# EAGLE design atxpsudevboard_0-1b (EAGLE 6.0)
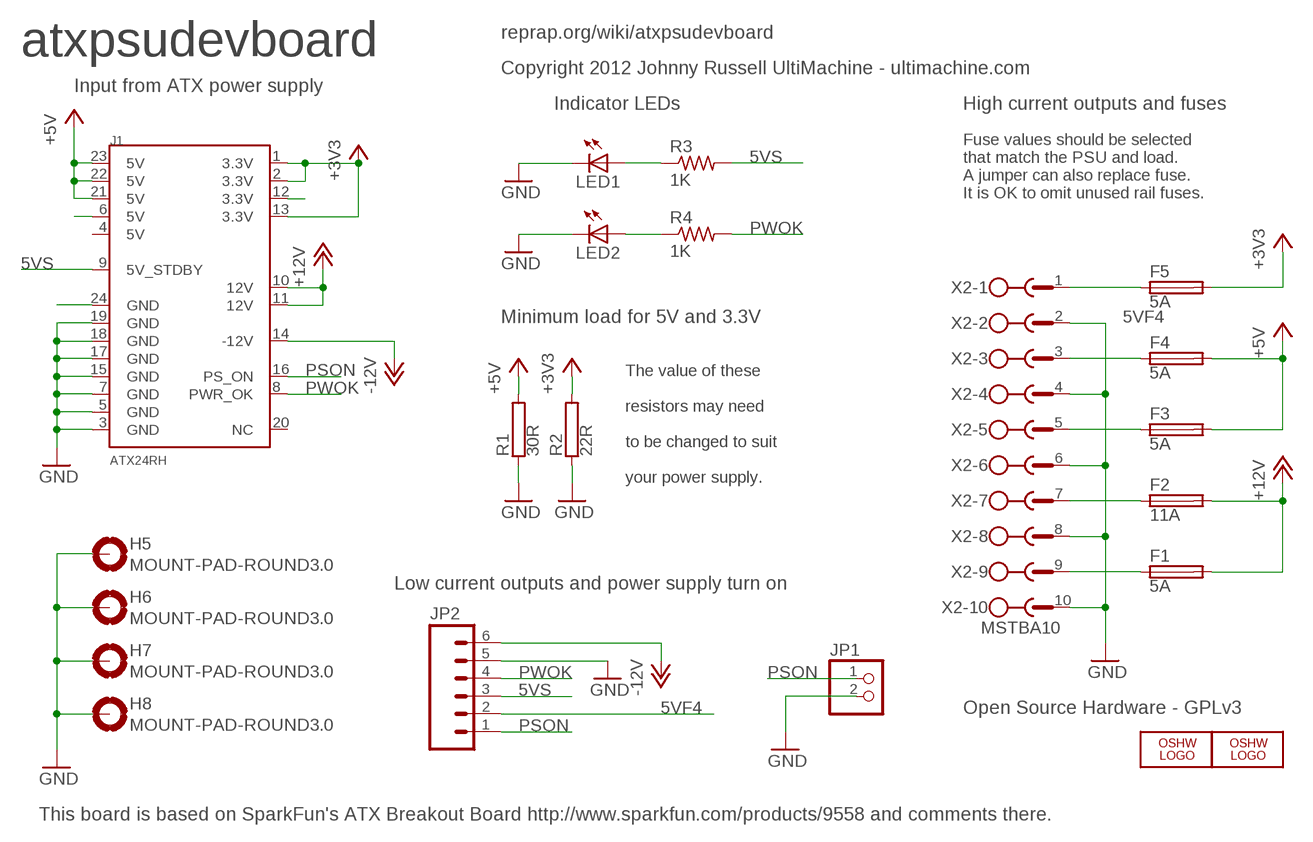
[diagram p0: schematic, sheet 1]

## Parts
F1  5A  PTCFUSEMFR1100  [MFR1100]
F2  11A  PTCFUSEMFR1100  [MFR1100]
F3  5A  PTCFUSEMFR1100  [MFR1100]
F4  5A  PTCFUSEMFR1100  [MFR1100]
F5  5A  PTCFUSEMFR1100  [MFR1100]
H5  MOUNT-PAD-ROUND3.0  [3,0-PAD]
H6  MOUNT-PAD-ROUND3.0  [3,0-PAD]
H7  MOUNT-PAD-ROUND3.0  [3,0-PAD]
H8  MOUNT-PAD-ROUND3.0  [3,0-PAD]
J1  ATX24RH  [ATX24_RIGHT_ANGLE]
JP1  PINHD-1X2  [1X02]
JP2  M06LONGPADS  [1X06_LONGPADS]
LED1  LED3MM  [LED3MM]
LED2  LED3MM  [LED3MM]
LOGO1  OSHW_LOGO_FILLX0100-NT  [OSHW_FILLX100_NOTEXT]
LOGO2  OSHW_LOGO_FILLX0200-NT  [OSHW_FILLX200_NOTEXT]
R1  30R  RHPS923  [HPS923]
R2  22R  RCA4050  [CA4050]
R3  1K  R-US_0207/7  [0207/7]
R4  1K  R-US_0207/7  [0207/7]
X2  MSTBA10  [MSTBA10]

## Nets
5VF4: F4.1 JP2.2 X2.3
5VS: J1.9(5V_STDBY) JP2.3 R3.2
+3V3: F5.2 J1.1(3.3V) J1.2(3.3V) J1.13(3.3V) R2.2
+5V: F3.2 F4.2 J1.21(5V) J1.22(5V) J1.23(5V) R1.2
+12V: F1.2 F2.2 J1.10(12V) J1.11(12V)
-12V: J1.14(-12V) JP2.6
GND: H5.B3,0(MOUNT) H6.B3,0(MOUNT) H7.B3,0(MOUNT) H8.B3,0(MOUNT) J1.3(GND) J1.5(GND) J1.7(GND) J1.15(GND) J1.17(GND) J1.18(GND) J1.19(GND) JP1.2 JP2.5 LED1.K(C) LED2.K(C) R1.1 R2.1 X2.2 X2.4 X2.6 X2.8 X2.10
N$1: F2.1 X2.7
N$2: F1.1 X2.9
N$3: J1.12(3.3V)
N$4: F3.1 X2.5
N$5: F5.1 X2.1
N$6: LED1.A R3.1
N$7: LED2.A R4.1
N$8: J1.6(5V)
N$9: J1.24(GND)
PSON: J1.16(PS_ON) JP1.1 JP2.1
PWOK: J1.8(PWR_OK) JP2.4 R4.2
Unconnected: J1.4(5V) J1.20(NC)

## Notes on the sheet
- reprap.org/wiki/atxpsudevboard
- atxpsudevboard
- Copyright 2012 Johnny Russell UltiMachine - ultimachine.com
- Input from ATX power supply
- Indicator LEDs | High current outputs and fuses
- Fuse values should be selected
- that match the PSU and load.
- A jumper can also replace fuse.
- It is OK to omit unused rail fuses.
- Minimum load for 5V and 3.3V
- The value of these
- resistors may need
- to be changed to suit
- your power supply.
- Low current outputs and power supply turn on
- Open Source Hardware - GPLv3
- This board is based on SparkFun's ATX Breakout Board http://www.sparkfun.com/products/9558 and comments there.

## Library data of the parts
F1-F5 = RepRapjr:PTCFUSE: LITTLEFUSE Picofuse/slow Littlefuse
H5-H8 = holes:MOUNT-PAD-ROUND: MOUNTING PAD, round
J1 = SparkFun:ATX24
JP1 = pinhead:PINHD-1X2: PIN HEADER
JP2 = SparkFun:M06: Header 6 Standard 6-pin 0.1" header. Use with straight break away headers (SKU : PRT-00116), right angle break away headers (PRT-00553), swiss pins (PRT-00743), machine pins (PRT-00117), and female headers (PRT-00115). Molex polarized connector foot print use with SKU : PRT-08094 with associated crimp pins and housings. NOTES ON THE VARIANTS LOCK and LOCK_LONGPADS... This footprint was designed to help hold the alignment of a through-hole component (i.e. 6-pin header) while soldering it into place. You may notice that each hole has been shifted either up or down by 0.005 of an inch from it's more standard position (which is a perfectly straight line). This slight alteration caused the pins (the squares in the middle) to touch the edges of the holes. Because they are alternating, it causes a "brace" to hold the component in place. 0.005 has proven to be the perfect amount of "off-center" position when using our standard breakaway headers. Although looks a little odd when you look at the bare footprint, once you have a header in there, the alteration is very hard to notice. Also, if you push a header all the way into place, it is covered up entirely on the bottom side. This idea of altering the position of holes to aid alignment will be further integrated into the Sparkfun Library for other footprints. It can help hold any component with 3 or more connection pins.
LED1 LED2 = led:LED: LED OSRAM: - CHIPLED LG R971, LG N971, LY N971, LG Q971, LY Q971, LO R971, LY R971 LH N974, LH R974 LS Q976, LO Q976, LY Q976 LO Q996 - Hyper CHIPLED LW Q18S LB Q993, LB Q99A, LB R99A - SideLED LS A670, LO A670, LY A670, LG A670, LP A670 LB A673, LV A673, LT A673, LW A673 LH A674 LY A675 LS A676, LA A676, LO A676, LY A676, LW A676 LS A679, LY A679, LG A679 - Hyper Micro SIDELED® LS Y876, LA Y876, LO Y876, LY Y876 LT Y87S - SmartLED LW L88C, LW L88S LB L89C, LB L89S, LG L890 LS L89K, LO L89K, LY L89K LS L896, LA L896, LO L896, LY L896 - TOPLED LS T670, LO T670, LY T670, LG T670, LP T670 LSG T670, LSP T670, LSY T670, LOP T670, LYG T670 LG T671, LOG T671, LSG T671 LB T673, LV T673, LT T673, LW T673 LH T674 LS T676, LA T676, LO T676, LY T676, LB T676, LH T676, LSB T676, LW T676 LB T67C, LV T67C, LT T67C, LS T67K, LO T67K, LY T67K, LW E67C LS E67B, LA E67B, LO E67B, LY E67B, LB E67C, LV E67C, LT E67C LW T67C LS T679, LY T679, LG T679 LS T770, LO T770, LY T770, LG T770, LP T770 LB T773, LV T773, LT T773, LW T773 LH T774 LS E675, LA E675, LY E675, LS T675 LS T776, LA T776, LO T776, LY T776, LB T776 LHGB T686 LT T68C, LB T68C - Hyper Mini TOPLED® LB M676 - Mini TOPLED Santana® LG M470 LS M47K, LO M47K, LY M47K Source: http://www.osram.convergy.de LUXEON: - LUMILED® LXK2-PW12-R00, LXK2-PW12-S00, LXK2-PW14-U00, LXK2-PW14-V00 LXK2-PM12-R00, LXK2-PM12-S00, LXK2-PM14-U00 LXK2-PE12-Q00, LXK2-PE12-R00, LXK2-PE12-S00, LXK2-PE14-T00, LXK2-PE14-U00 LXK2-PB12-K00, LXK2-PB12-L00, LXK2-PB12-M00, LXK2-PB14-N00, LXK2-PB14-P00, LXK2-PB14-Q00 LXK2-PR12-L00, LXK2-PR12-M00, LXK2-PR14-Q00, LXK2-PR14-R00 LXK2-PD12-Q00, LXK2-PD12-R00, LXK2-PD12-S00 LXK2-PH12-R00, LXK2-PH12-S00 LXK2-PL12-P00, LXK2-PL12-Q00, LXK2-PL12-R00 Source: www.luxeon.com KINGBRIGHT: KA-3528ASYC Source: www.kingbright.com
LOGO1 LOGO2 = OSHW:OSHW_LOGO_FILL
R1 R2 = resistor-power:R: Power Resitor; OC_FARNELL: unknown; OC_NEWARK: unknown
R3 R4 = resistor:R-US_: RESISTOR, American symbol
X2 = con-phoenix-508:MSTBA10: PHOENIX; MF: FARNELL; MPN: 1757323; OC_FARNELL: 3705249; OC_NEWARK: 71C4168

## Board
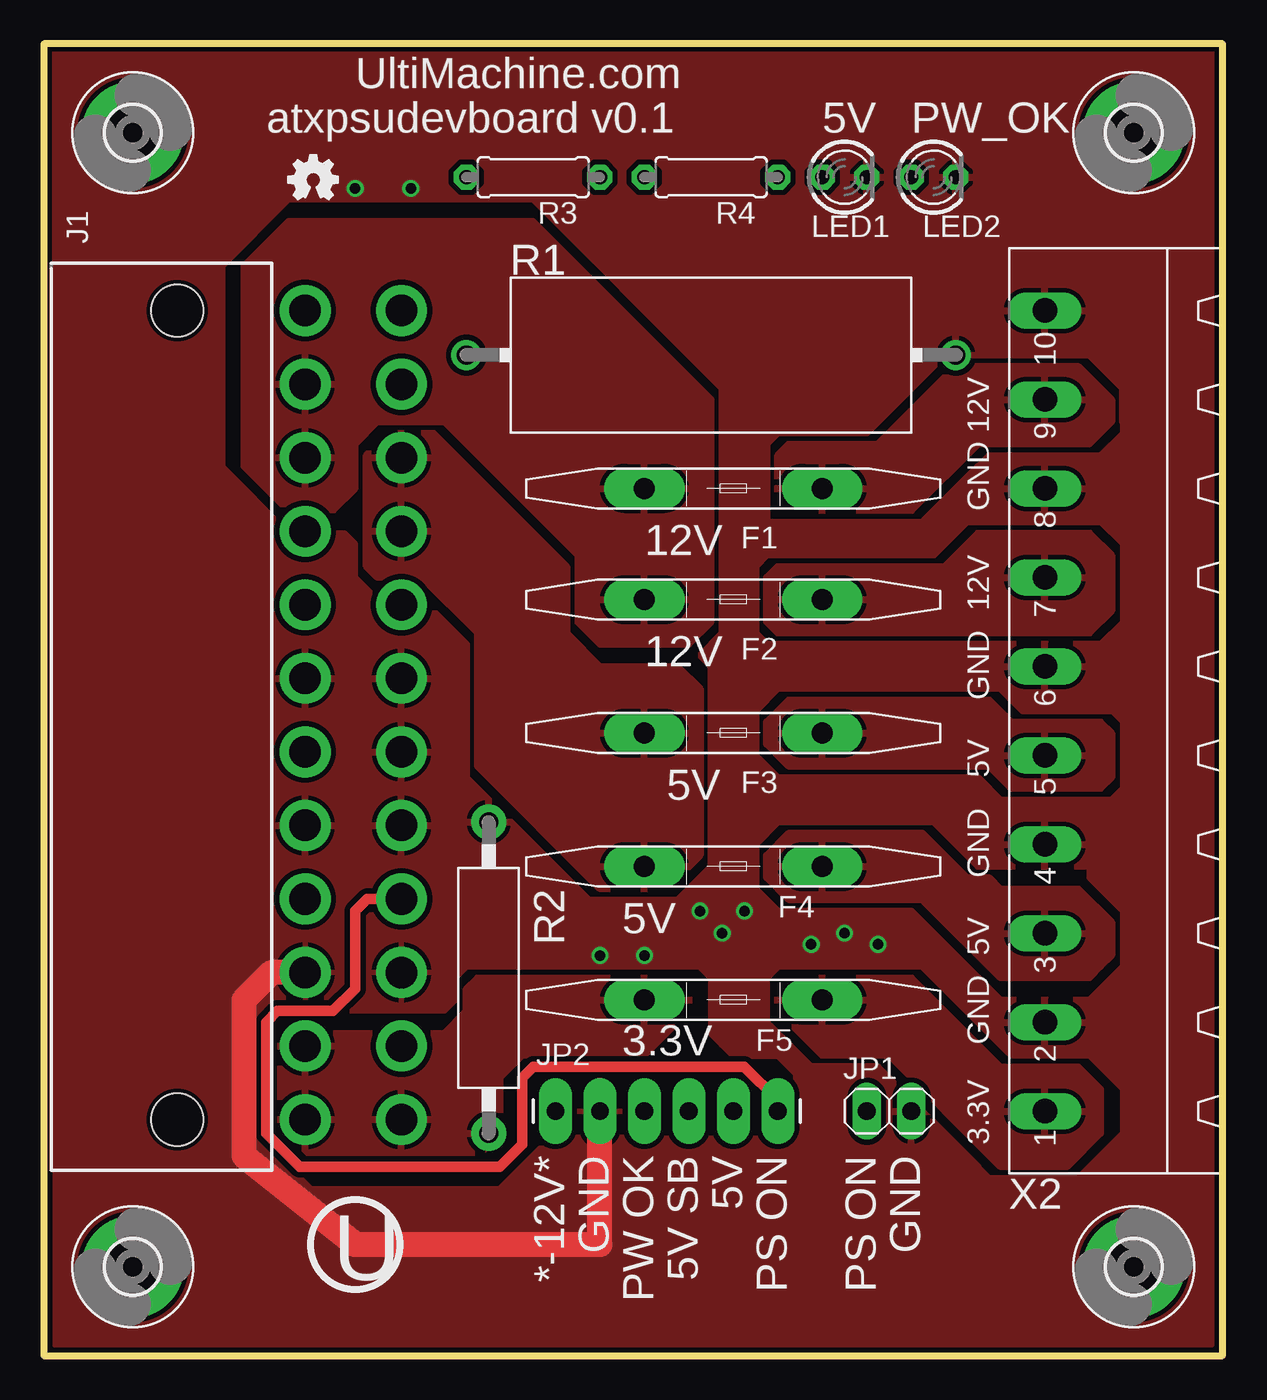
[diagram p1: board, top side]
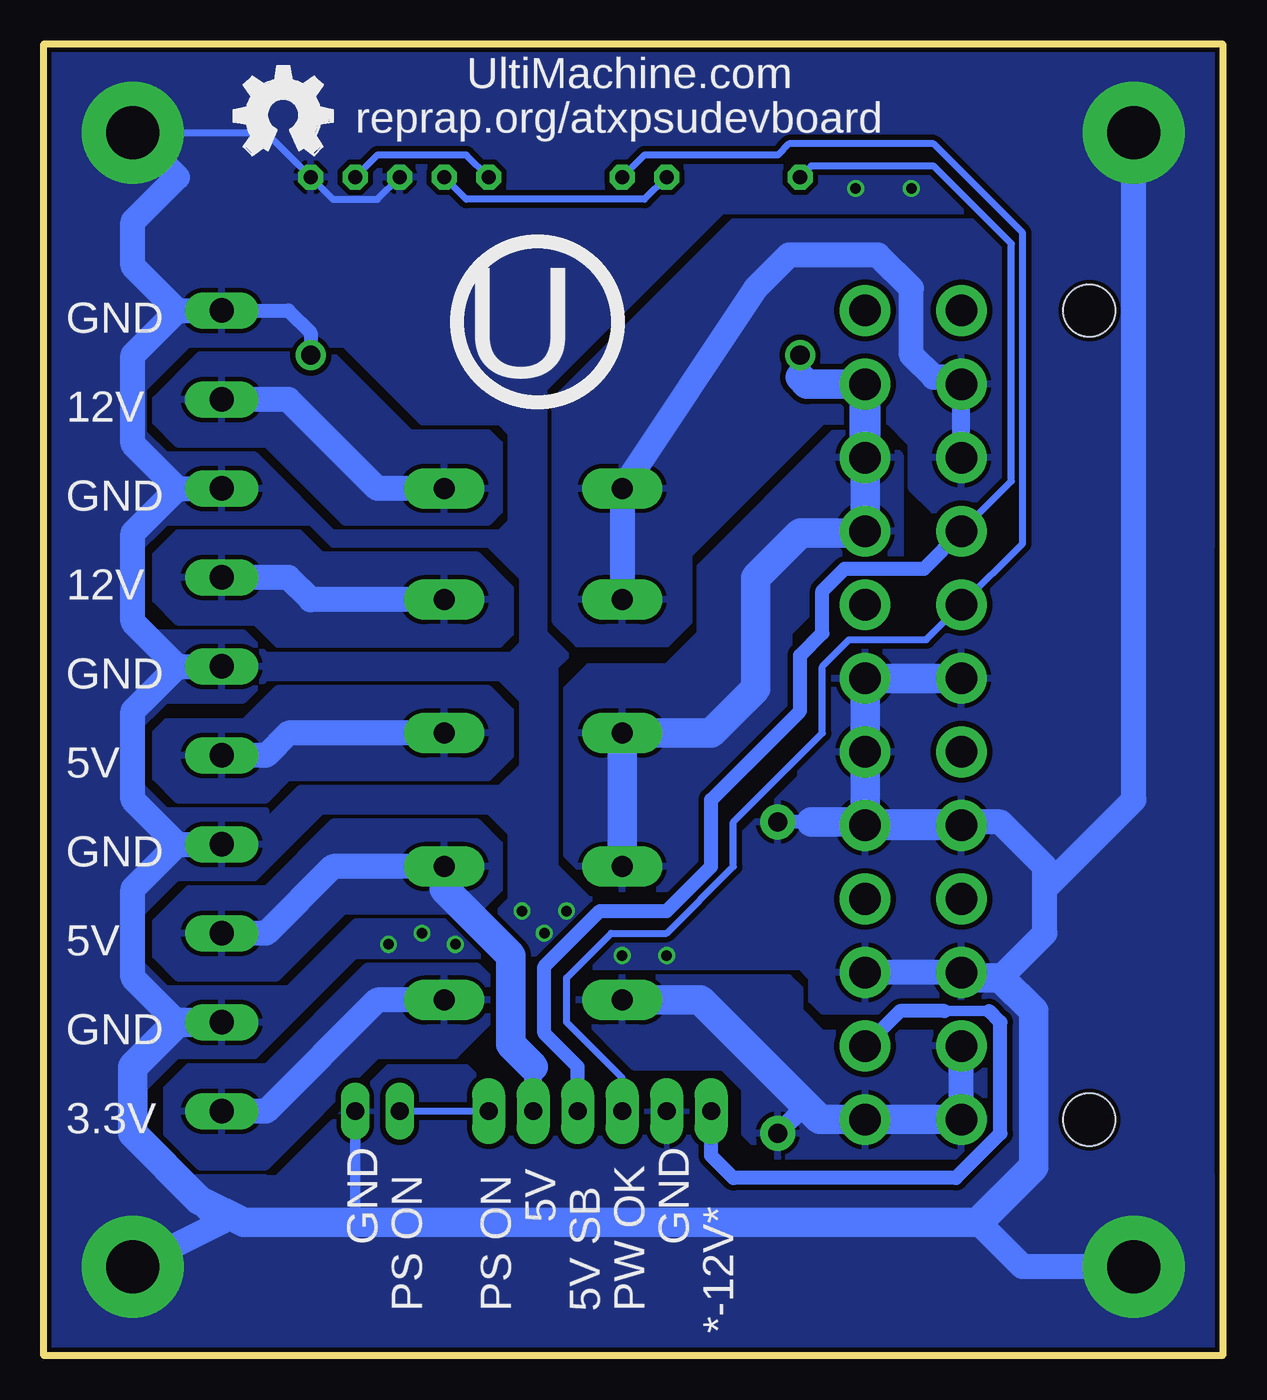
[diagram p2: board, bottom side, seen from below]

Size 67.31 x 74.93 mm. Coordinates in mm from the lower left corner, seen from the top.
Outline: 0,0 67.31,0 67.31,74.93 0,74.93 0,0
Copper layers (1*16): Top 0.035mm / dielectric 1.5mm / Bottom 0.035mm
Design rules: minimum track width 7mil, minimum drill 15mil, track to track 12mil, track to pad 12mil, pad to pad 7mil, via to via 7mil, smd to smd 7mil, copper to edge 10mil, drill to drill 8mil, minimum pad ring 12mil, minimum via ring 7mil, stop-mask expansion 4mil, vias tented up to drill 25mil, thermal gap 10mil

### Footprints (pad centres in the part's own frame; a part is rotated, then mirrored left to right if it is on the bottom)
MFR1100 = drill 1.2 pad 2.3 long: 1 -5.08,0; 2 5.08,0
3,0-PAD = drill 3 pad 5.842: B3,0 0,0
ATX24_RIGHT_ANGLE = drill 1.8 pad 2.9: 1 23.34,4.76; 2 19.14,4.76; 3 14.94,4.76; 4 10.74,4.76; 5 6.54,4.76; 6 2.34,4.76; 7 -1.86,4.76; 8 -6.06,4.76; 9 -10.26,4.76; 10 -14.46,4.76; 11 -18.66,4.76; 12 -22.86,4.76; 13 23.34,10.26; 14 19.14,10.26; 15 14.94,10.26; 16 10.74,10.26; 17 6.54,10.26; 18 2.34,10.26; 19 -1.86,10.26; 20 -6.06,10.26; 21 -10.26,10.26; 22 -14.46,10.26; 23 -18.66,10.26; 24 -22.86,10.26 | hole 3: -22.86,-2.54; 23.34,-2.54
1X02 = drill 1.016 long: 1 -1.27,0; 2 1.27,0
1X06_LONGPADS = drill 1.016 pad 1.88 long: 1 0,0; 2 2.54,0; 3 5.08,0; 4 7.62,0; 5 10.16,0; 6 12.7,0
LED3MM = drill 0.813 octagon: A -1.27,0; K 1.27,0
HPS923 = drill 1.1 pad 1.7: 1 -13.97,0; 2 13.97,0
CA4050 = drill 1.1 pad 2: 1 -8.89,0; 2 8.89,0
0207/7 = drill 0.813 octagon: 1 -3.81,0; 2 3.81,0
MSTBA10 = drill 1.397 long: 1 -22.86,5.08; 2 -17.78,5.08; 3 -12.7,5.08; 4 -7.62,5.08; 5 -2.54,5.08; 6 2.54,5.08; 7 7.62,5.08; 8 12.7,5.08; 9 17.78,5.08; 10 22.86,5.08

### Placement (x,y rotation side)
F1  39.37,49.53 180 top
F2  39.37,43.18 180 top
F3  39.37,35.56 180 top
F4  39.37,27.94 180 top
F5  39.37,20.32 180 top
H5  5.08,5.08 0 top
H6  5.08,69.85 0 top
H7  62.23,69.85 0 top
H8  62.23,5.08 0 top
J1  10.16,36.83 270 top
JP1  48.26,13.97 0 top
JP2  41.91,13.97 180 top
LED1  45.72,67.31 0 top
LED2  50.8,67.31 0 top
LOGO1  13.97,66.04 0 top
LOGO2  50.8,68.58 0 top
R1  38.1,57.15 180 top
R2  25.4,21.59 270 top
R3  27.94,67.31 180 top
R4  38.1,67.31 180 top
X2  62.23,36.83 90 top

### Tracks (layer width: path | path; a pad name or v marks a point on that pad's centre or on a via)
5VF4
  Bottom 1.016: JP2.2 39.37,16.51
  Bottom 1.422: X2.3 54.61,24.13 50.8,27.94 F4.1
  Bottom 1.676: 39.37,16.51 40.64,17.78 40.64,22.86 44.45,26.67 F4.1
  pour Top: 41.27,28.57 42.55,29.84 50.16,29.84 52.7,27.3 53.98,27.3 54.61,26.67 59.05,26.67 60.96,24.77 60.96,22.86 60.33,22.23 59.69,21.59 54.61,21.59 50.16,26.04 42.55,26.04 41.27,27.3
  pour Bottom: 41.27,29.21 42.55,30.48 50.8,30.48 54.61,26.67 59.05,26.67 60.96,24.77 60.96,22.86 59.69,21.59 53.98,21.59 50.16,25.4 42.55,25.4 41.27,26.67
5VS
  Bottom 0.406: J1.9 12.06,49.95 12.06,63.5 16.51,67.94 23.5,67.94 R3.2
  Bottom 0.813: JP2.3 36.83,16.51 38.73,18.41 38.73,22.23 35.56,25.4 31.75,25.4 29.21,27.94 29.21,31.75 24.13,36.83 24.13,40.01 22.86,41.27 22.86,43.69 21.59,44.96 17.05,44.96 J1.9
+3V3
  Bottom 1.016: 23.81,14.29 R2.2
  Bottom 1.422: J1.1 J1.2
  Bottom 1.676: F5.2 29.84,20.32 23.81,14.29 23.02,13.49 J1.13 J1.1
  pour Top: 13.34,17.78 13.97,18.41 22.86,18.41 24.13,19.68 24.13,20.95 24.77,21.59 36.2,21.59 36.83,20.95 36.83,19.68 34.29,17.14 27.3,17.14 26.04,15.88 26.04,12.7 24.77,11.43 15.24,11.43 13.34,13.34
  pour Bottom: 13.34,17.14 15.24,19.05 15.88,18.41 22.86,18.41 24.13,19.68 24.13,20.95 24.77,21.59 36.2,21.59 36.83,20.95 36.83,19.68 33.66,16.51 28.57,16.51 27.3,15.24 27.3,12.7 26.04,11.43 15.24,11.43 13.34,13.34
+5V
  Bottom 1.016: 24.13,55.88 R1.2
  Bottom 1.676: F4.2 F3.2 29.21,35.56 26.67,38.1 26.67,44.45 24.13,46.99 20.52,46.99 J1.21 J1.22 | J1.23 23.74,55.49 24.13,55.88
  Bottom 1.778: J1.22 J1.23
  pour Top: 18.41,51.44 19.68,52.7 22.23,52.7 29.84,45.09 29.84,41.27 31.75,39.37 36.2,39.37 37.47,38.1 37.47,28.57 35.56,26.67 31.75,26.67 24.77,33.66 24.77,41.27 21.59,44.45 19.05,44.45 18.41,45.09
  pour Bottom: 22.23,52.7 19.68,52.7 18.41,51.44 18.41,45.09 19.05,44.45 21.59,44.45 24.77,41.27 24.77,33.66 31.75,26.67 35.56,26.67 37.47,28.57 37.47,38.1 36.2,39.37 31.75,39.37 29.84,41.27 29.84,45.09
+12V
  Bottom 1.016: J1.10 J1.11
  Bottom 1.422: J1.11 15.31,55.88 16.51,55.88 17.78,57.15 17.78,60.96 19.68,62.87 24.77,62.87 26.67,60.96 F1.2 F2.2
  pour Top: 11.43,50.8 13.97,48.26 16.51,48.26 17.78,49.53 17.78,52.07 19.05,53.34 22.86,53.34 30.48,45.72 30.48,41.91 31.75,40.64 36.83,40.64 38.1,41.91 38.1,54.61 27.94,64.77 13.97,64.77 11.43,62.23
  pour Bottom: 11.43,62.23 11.43,50.8 13.34,48.9 13.97,48.26 16.51,48.26 17.78,49.53 17.78,52.07 19.05,53.34 22.86,53.34 30.48,45.72 30.48,41.91 31.75,40.64 36.83,40.64 38.1,41.91 38.1,54.61 27.94,64.77 13.97,64.77
-12V
  Bottom 0.61: 13.34,19.68 15.88,19.68
  Bottom 0.813: 13.34,19.68 12.7,19.05 12.7,12.7 15.24,10.16 27.94,10.16 29.21,11.43 JP2.6 | 15.88,19.68 18.43,19.68 J1.14
GND  (via drill 0.6)
  Top 1.422: JP2.5 31.75,6.35 17.78,6.35 11.43,11.43 11.43,20.32 13,21.89 J1.3
  Bottom 0.406: LED1.K 48.26,66.04 50.8,66.04 LED2.K 54.61,69.85 H7.B3,0
  Bottom 0.61: 49.53,7.62 JP1.2
  Bottom 0.813: R1.1 52.07,58.42 53.34,59.69 X2.10 | 23.5,30.48 R2.1
  Bottom 1.422: J1.3 J1.15 | 59.69,59.69 62.23,57.15 62.23,52.07 59.69,49.53 | 59.69,49.53 X2.8 | 59.69,39.37 X2.6 | 59.69,39.37 62.23,41.91 62.23,46.99 59.69,49.53 | 59.69,29.21 X2.4 | 59.69,29.21 62.23,31.75 62.23,36.83 59.69,39.37 | 59.69,19.05 62.23,21.59 62.23,26.67 59.69,29.21 | J1.17 20.23,30.48 12.7,30.48 10.16,27.94 10.16,26.67 | 10.16,26.67 10.16,24.13 12.7,21.59 | H6.B3,0 5.08,31.75 10.16,26.67 | 59.69,59.69 X2.10 | 59.69,59.69 62.23,62.23 62.23,64.77 59.69,67.31 H7.B3,0 | 13.97,7.62 11.43,5.08 H5.B3,0 | H8.B3,0 57.15,7.62 58.42,8.89
  Bottom 1.676: X2.2 59.69,19.05 62.23,16.51 62.23,12.7 58.42,8.89 55.88,7.62 49.53,7.62 13.97,7.62 10.79,10.79 10.79,19.68 12.7,21.59 14.62,21.59 J1.3 | J1.17 J1.5 | J1.17 J1.18 J1.19 J1.7 | 23.5,30.48 20.61,30.48 J1.17
  other vias: 38.73,24.13 40.01,25.4 37.47,25.4 31.75,22.86 34.29,22.86 43.81,23.5 45.72,24.13 47.62,23.5 17.78,66.67 20.95,66.67
  pour Bottom: 0,74.93 67.31,74.93 67.31,53.34 61.59,53.34 61.59,55.24 59.05,57.78 56.52,57.78 55.88,58.42 55.88,60.33 50.8,65.41 35.56,65.41 32.38,68.58 15.24,68.58 10.79,64.14 10.79,46.35 0,46.35
  pour Bottom: 67.31,54.61 67.31,0 54.61,0 54.61,10.16 59.69,10.16 61.59,12.06 61.59,15.24 59.69,17.14 55.24,17.14 55.24,20.95 60.33,20.95 62.23,22.86 62.23,24.77 59.69,27.3 55.24,27.3 54.61,27.94 54.61,31.11 60.33,31.11 62.23,33.02 62.23,35.56 60.33,37.47 55.88,37.47 55.88,41.27 60.96,41.27 62.23,42.55 62.23,45.72 60.33,47.62 54.61,47.62 53.98,48.26 53.98,50.16 55.24,51.44 60.33,51.44 61.59,52.7 61.59,54.61
  pour Bottom (no thermals): 0,10.16 10.16,10.16 10.16,0 0,0
  pour Bottom (no thermals): 57.15,10.16 67.31,10.16 67.31,0 57.15,0
  pour Bottom (no thermals): 55.88,74.93 67.31,74.93 67.31,64.77 55.88,64.77
  pour Bottom (no thermals): 0,74.93 10.16,74.93 10.16,66.04 0,66.04
  pour Top: 0,74.93 67.31,74.93 67.31,53.34 61.59,53.34 61.59,55.24 59.05,57.78 56.52,57.78 55.88,58.42 55.88,60.33 50.8,65.41 35.56,65.41 34.92,66.04 13.97,66.04 10.16,62.23 10.16,49.53 0,49.53
  pour Top: 11.43,43.18 21.59,43.18 24.13,40.64 24.13,33.02 31.11,26.04 36.2,26.04 38.1,27.94 38.1,38.1 40.64,40.64 63.5,40.64 63.5,36.83 55.88,36.83 54.61,38.1 41.91,38.1 40.64,36.83 40.64,34.29 41.91,33.02 53.34,33.02 54.61,31.75 63.5,31.75 63.5,27.94 53.34,27.94 50.8,30.48 41.91,30.48 40.64,29.21 40.64,26.67 41.91,25.4 49.53,25.4 54.61,20.32 60.96,20.32 60.96,17.14 55.24,17.14 50.16,22.23 23.5,22.23 17.78,27.94 11.43,27.94
  pour Top: 36.83,23.5 36.83,22.86 38.1,21.59 38.1,18.41 38.73,17.78 39.37,17.14 41.91,17.14 43.18,15.88 43.18,12.06 41.27,10.16 53.34,10.16 53.34,10.79 47.62,16.51 43.81,16.51 41.27,19.05 41.27,21.59 43.18,23.5
  pour Top: 38.1,37.47 38.1,39.37 37.47,40.01 38.73,41.27 38.73,46.35 40.01,47.62 50.16,47.62 53.34,50.8 62.87,50.8 62.87,47.62 52.7,47.62 51.44,46.35 50.8,45.72 41.27,45.72 40.64,45.09 40.64,41.27 41.91,40.01 40.64,40.01
  pour Top: 38.73,45.09 38.73,55.24 27.3,66.67 55.24,66.67 61.59,60.33 61.59,57.15 60.96,56.52 60.33,56.52 59.69,57.15 51.44,57.15 46.99,52.7 41.91,52.7 41.27,52.07 41.27,46.99 40.64,46.99
  pour Bottom: 8.89,43.18 21.59,43.18 24.13,40.64 24.13,33.02 31.11,26.04 36.2,26.04 38.1,27.94 38.1,39.37 37.47,40.01 38.73,41.27 38.73,55.24 28.57,65.41 10.79,65.41 10.79,66.67 13.97,69.85 51.44,69.85 60.96,60.33 60.96,59.69 59.05,57.78 50.16,57.78 45.72,53.34 41.27,53.34 40.64,52.7 40.64,47.62 41.27,46.99 50.8,46.99 54.61,50.8 54.61,47.62 52.07,47.62 50.8,46.35 41.91,46.35 40.01,44.45 40.01,40.64 40.64,40.01 54.61,40.01 55.88,41.27 57.78,41.27 58.42,40.64 58.42,38.73 57.15,37.47 55.88,37.47 54.61,38.73 41.27,38.73 40.01,37.47 40.01,33.66 41.27,32.38 52.7,32.38 55.24,29.84 55.24,27.94 54.61,27.94 51.44,31.11 41.91,31.11 40.64,29.84 40.64,26.04 41.91,24.77 49.53,24.77 53.34,20.95 57.15,20.95 57.78,20.32 57.78,18.41 56.52,17.14 55.24,17.14 49.53,22.86 38.1,22.86 37.47,22.23 24.13,22.23 23.5,21.59 23.5,20.32 22.86,19.68 9.53,19.68 8.89,20.32
  pour Top: 61.59,53.98 61.59,52.7 60.33,51.44 53.98,51.44 53.34,50.8 53.34,48.9 54.61,47.62 60.33,47.62 61.59,46.35 61.59,41.91 60.33,40.64 60.33,37.47 61.59,36.2 61.59,32.38 60.33,31.11 60.33,28.57 59.69,27.94 59.69,27.3 61.59,25.4 61.59,22.23 59.69,20.32 59.69,17.14 61.59,15.24 61.59,12.7 59.05,10.16 53.98,10.16 52.7,11.43 52.7,0.64 66.67,0.64 66.67,53.98
  pour Top: 10.16,50.8 13.97,46.99 17.14,46.99 17.78,46.35 17.78,44.45 19.05,43.18 19.05,29.21 24.77,23.5 24.77,22.86 23.5,21.59 23.5,20.32 22.86,19.68 12.7,19.68 11.43,18.41 11.43,13.34 15.24,9.53 26.04,9.53 28.57,12.06 28.57,13.97 30.48,15.88 48.26,15.88 55.24,8.89 55.24,0.64 0.64,0.64 0.64,50.8
  pour Bottom: 10.16,48.26 17.78,40.64 17.78,21.59 16.51,21.59 12.7,17.78 12.7,12.7 15.24,10.16 26.67,10.16 29.21,12.7 30.48,13.97 40.64,13.97 43.18,16.51 47.62,16.51 53.98,10.16 55.24,10.16 55.24,0.64 0.64,0.64 0.64,48.26
N$1
  Bottom 1.422: F2.1 52.07,43.18 53.34,44.45 X2.7
  pour Top: 41.91,41.27 41.27,41.91 41.27,44.45 41.91,45.09 51.44,45.09 53.34,46.99 59.69,46.99 60.96,45.72 60.96,42.55 59.69,41.27
  pour Bottom: 40.64,43.81 42.55,45.72 51.44,45.72 52.7,46.99 59.69,46.99 60.96,45.72 60.96,43.18 59.69,41.91 55.24,41.91 53.98,40.64 41.27,40.64 40.64,41.27
N$2
  Bottom 1.422: F1.1 48.26,49.53 53.34,54.61 X2.9
  Bottom 1.676: X2.9 58.42,54.61
  pour Top: 41.91,51.44 42.55,52.07 47.62,52.07 52.07,56.52 59.05,56.52 60.96,54.61 60.96,53.34 59.69,52.07 53.34,52.07 49.53,48.26 42.55,48.26 41.91,48.9
  pour Bottom: 41.27,50.16 41.27,52.07 41.91,52.7 46.35,52.7 50.8,57.15 58.42,57.15 60.96,54.61 60.96,53.34 59.69,52.07 54.61,52.07 50.16,47.62 41.91,47.62 41.27,48.26
N$4
  Bottom 1.422: F3.1 53.34,35.56 54.61,34.29 X2.5
  pour Top: 41.27,36.2 42.55,37.47 53.98,37.47 55.24,36.2 60.33,36.2 60.96,35.56 60.96,33.02 60.33,32.38 55.24,32.38 53.98,33.66 42.55,33.66 41.91,34.29 41.27,34.92
  pour Bottom: 40.64,36.83 41.91,38.1 53.98,38.1 55.88,36.2 60.33,36.2 60.96,35.56 60.96,33.02 59.69,31.75 54.61,31.75 53.34,33.02 41.91,33.02 40.64,34.29
N$5
  Bottom 1.422: F5.1 48.26,20.32 54.61,13.97 X2.1
  pour Top: 41.91,20.95 42.55,21.59 49.53,21.59 54.61,16.51 59.05,16.51 60.33,15.24 60.33,12.7 58.42,10.79 54.61,10.79 48.26,17.14 44.45,17.14 41.91,19.68
  pour Bottom: 41.27,20.95 42.55,22.23 48.9,22.23 54.61,16.51 59.05,16.51 60.33,15.24 60.33,12.7 58.42,10.79 54.61,10.79 48.26,17.14 43.81,17.14 41.27,19.68
N$6
  Bottom 0.406: R3.1 33.02,66.04 43.18,66.04 LED1.A
N$7
  Bottom 0.406: R4.1 43.18,68.58 48.26,68.58 LED2.A
PSON
  Top 0.61: J1.16 18.47,26.09 17.78,25.4 17.78,20.95 16.51,19.68 13.34,19.68 12.7,19.05 12.7,12.7 14.61,10.79 26.04,10.79 27.3,12.06 27.3,15.88 27.94,16.51 40.01,16.51 41.91,14.61 JP2.1
  Bottom 0.406: JP2.1 JP1.1
PWOK
  Bottom 0.406: R4.2 33.02,68.58 25.4,68.58 24.77,69.22 16.51,69.22 11.43,64.14 11.43,46.38 J1.8 16.92,40.89 21.34,40.89 22.86,39.37 22.86,35.56 27.94,30.48 27.94,27.94 31.75,24.13 34.92,24.13 37.47,21.59 37.47,19.05 34.29,15.88 JP2.4

### Text on the board
_tsilk: UltiMachine.com | atxpsudevboard v0.1 | 5V | PW_OK | 12V | GND | 12V | 12V | 12V | GND | 5V | 5V | GND | 5V | 5V | GND | 3.3V | 3.3V | *-12V* | GND | PW OK | 5V SB | 5V | PS ON | PS ON | GND | U
_bsilk: UltiMachine.com | reprap.org/atxpsudevboard | GND | U | 12V | GND | 12V | GND | 5V | GND | 5V | GND | 3.3V | 5V | GND | GND | PW OK | 5V SB | PS ON | PS ON | *-12V*